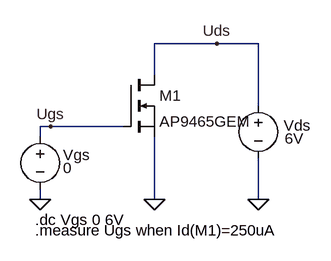
[diagram p0: schematic ID_vs_UGS-5_1.asc]
ID_vs_UGS-5_1.asc, the LTspice schematic file:
Version 4
SHEET 1 1292 680
WIRE -624 -176 -720 -176
WIRE -560 -176 -624 -176
WIRE -720 -128 -720 -176
WIRE -560 -80 -560 -176
WIRE -880 -48 -896 -48
WIRE -768 -48 -880 -48
WIRE -896 -32 -896 -48
WIRE -896 64 -896 48
WIRE -720 64 -720 -32
WIRE -560 64 -560 0
FLAG -560 64 0
FLAG -896 64 0
FLAG -720 64 0
FLAG -880 -48 Ugs
FLAG -624 -176 Uds
SYMBOL voltage -560 -96 R0
WINDOW 123 0 0 Left 2
WINDOW 39 36 73 Left 2
WINDOW 0 39 46 Left 2
WINDOW 3 41 66 Left 2
SYMATTR InstName Vds
SYMATTR Value 6V
SYMBOL voltage -896 -48 R0
WINDOW 123 0 0 Left 2
WINDOW 39 40 53 Left 2
WINDOW 3 35 64 Left 2
WINDOW 0 35 44 Left 2
SYMATTR Value 0
SYMATTR InstName Vgs
SYMBOL nmos -768 -128 R0
SYMATTR InstName M1
SYMATTR Value AP9465GEM
TEXT -904 96 Left 2 !.dc Vgs 0 6V
TEXT -904 112 Left 2 !.measure Ugs when Id(M1)=250uA

The netlist it stands for:
* ID_vs_UGS-5_1.asc
Vds Uds 0 6V
Vgs Ugs 0 0
M1 Uds Ugs 0 0 AP9465GEM
.model NMOS NMOS
.model PMOS PMOS
.lib standard.mos
.dc Vgs 0 6V
.measure Ugs when Id(M1)=250uA
.backanno
.end